# Altium project FSM.PrjPcb
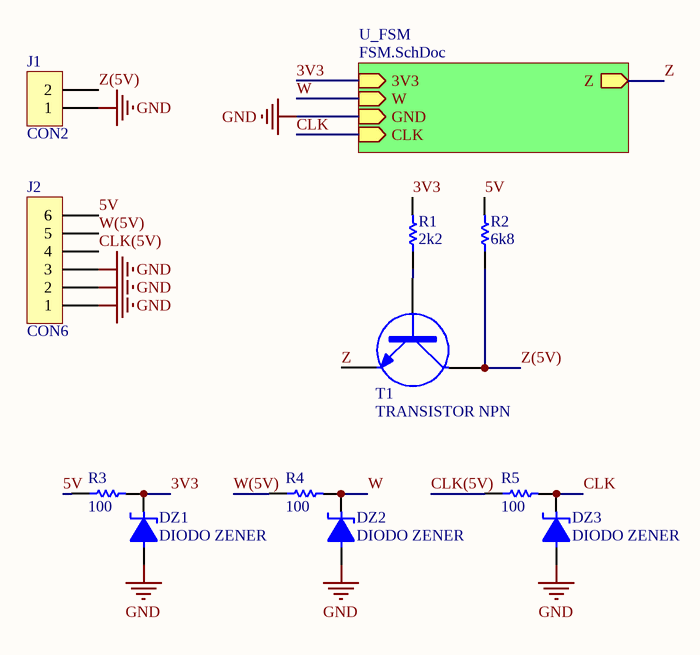
[diagram p0: Casing.SchDoc]
2 sheets, 17 parts. Net scope: hierarchical (ports join the sheet entries above them; power ports are global).
Board file: FSM.PcbDoc
Sheets:
  Casing.SchDoc
    U_FSM = FSM.SchDoc

## Sheet Casing.SchDoc
size A

### Parts
DZ1  DIODO ZENER  [DO41]
DZ2  DIODO ZENER  [DO41]
DZ3  DIODO ZENER  [DO41]
J1  CON2  [SIP2]
J2  CON6  [SIP6]
R1  2k2  [0805]
R2  6k8  [0805]
R3  100  [0805]
R4  100  [0805]
R5  100  [0805]
T1  TRANSISTOR NPN  [TO92]

### Sub-sheets
U_FSM = FSM.SchDoc: 3V3 (in), W (in), Z (out), GND (in), CLK (in)

### Nets
GND: DZ1.1 DZ2.1 DZ3.1 J1.1 J2.1 J2.2 J2.3 ; sheet U_FSM/GND  [project net GND']
3V3: DZ1.2 R1.2 R3.2 ; sheet U_FSM/3V3
5V: J2.6 R2.2 R3.1
CLK: DZ3.2 R5.2 ; sheet U_FSM/CLK
CLK(5V): J2.4 R5.1
W: DZ2.2 R4.2 ; sheet U_FSM/W
W(5V): J2.5 R4.1
Z: T1.3(E) ; sheet U_FSM/Z
Z(5V): J1.2 R2.1 T1.2(C)
NetR1_1: R1.1 T1.1(B)

### Library data of the parts
R1-R5 = RES

## Sheet FSM.SchDoc
size A
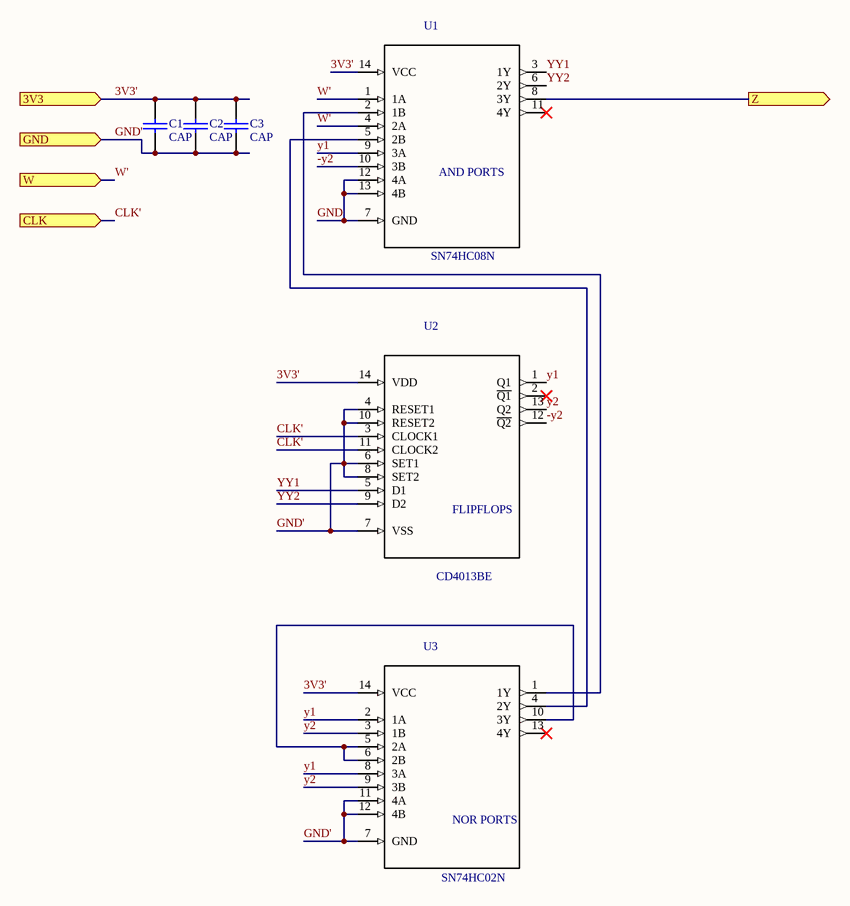
[diagram p1: FSM.SchDoc]

### Parts
C1  CAP  [0805]
C2  CAP  [0805]
C3  CAP  [0805]
U1  SN74HC08N  [*DIP254P762X508-14]
U2  CD4013BE  [*DIP254P762X508-14]
U3  SN74HC02N  [*DIP254P762X508-14]

### Ports
3V3 (in), CLK (in), GND (in), W (in), Z (out)

### Nets
GND': C1.2 C2.2 C3.2 U1.7(GND) U1.12(4A) U1.13(4B) U2.4(RESET1) U2.6(SET1) U2.7(VSS) U2.8(SET2) U2.10(RESET2) U3.7(GND) U3.11(4A) U3.12(4B) ; port GND
3V3': C1.1 C2.1 C3.1 U1.14(VCC) U2.14(VDD) U3.14(VCC) ; port 3V3  [project net 3V3]
-y2: U1.10(3B) U2.12(~{Q2})
CLK': U2.3(CLOCK1) U2.11(CLOCK2) ; port CLK  [project net CLK]
W': U1.1(1A) U1.4(2A) ; port W  [project net W]
y1: U1.9(3A) U2.1(Q1) U3.2(1A) U3.8(3A)
y2: U2.13(Q2) U3.3(1B) U3.9(3B)
YY1: U1.3(1Y) U2.5(D1)
YY2: U1.6(2Y) U2.9(D2)
Z: U1.8(3Y) ; port Z
NetU1_2: U1.2(1B) U3.1(1Y)
NetU1_5: U1.5(2B) U3.4(2Y)
NetU3_5: U3.5(2A) U3.6(2B) U3.10(3Y)

Not connected (* = marked no-connect by the designer): U1 11(4Y)*; U2 2(~{Q1})*; U3 13(4Y)*

### Notes on the sheet
- (near U1) AND PORTS
- (near U2) FLIPFLOPS
- (near U3) NOR PORTS

### Library data of the parts
U1 = SN74HC08N: AND Gate 4-Element 2-IN CMOS 14-Pin PDIP Tube; MF: Texas Instruments; SnapEDA_Link: https://www.snapeda.com/parts/SN74HC08N/Texas%20Instruments/view-part/?ref=snap; Price: None; MP: SN74HC08N; Availability: Unavailable; Package: PDIP-14 Signetics; Value: *
U2 = CD4013BE: Flip Flop D-Type Pos-Edge 2-Element 14-Pin PDIP; MF: Texas; Package: DIP-14 RCA; Availability: Unavailable; MP: CD4013BE; SnapEDA_Link: https://www.snapeda.com/parts/CD4013BE/Texas%20Instruments/view-part/?ref=snap; Price: None; Value: *
U3 = SN74HC02N: IC: digital; Channels: 4; NOR; Inputs: 2; THT; DIP14; Ser; MF: Texas Instruments; MP: SN74HC02N; SnapEDA_Link: https://www.snapeda.com/parts/SN74HC02N/Texas%20Instruments/view-part/?ref=snap; Availability: Unavailable; Package: DIP-14 Texas Instruments; Price: None; Value: *

## Nets that join several sheets
GND': Casing (7 pins), FSM (14 pins)
3V3: Casing (DZ1.2 R1.2 R3.2), FSM (6 pins)
CLK: Casing (DZ3.2 R5.2), FSM (U2.3 U2.11)
W: Casing (DZ2.2 R4.2), FSM (U1.1 U1.4)
Z: Casing (T1.3), FSM (U1.8)